# EAGLE design CarBot_Pedro (EAGLE 9.6.2)
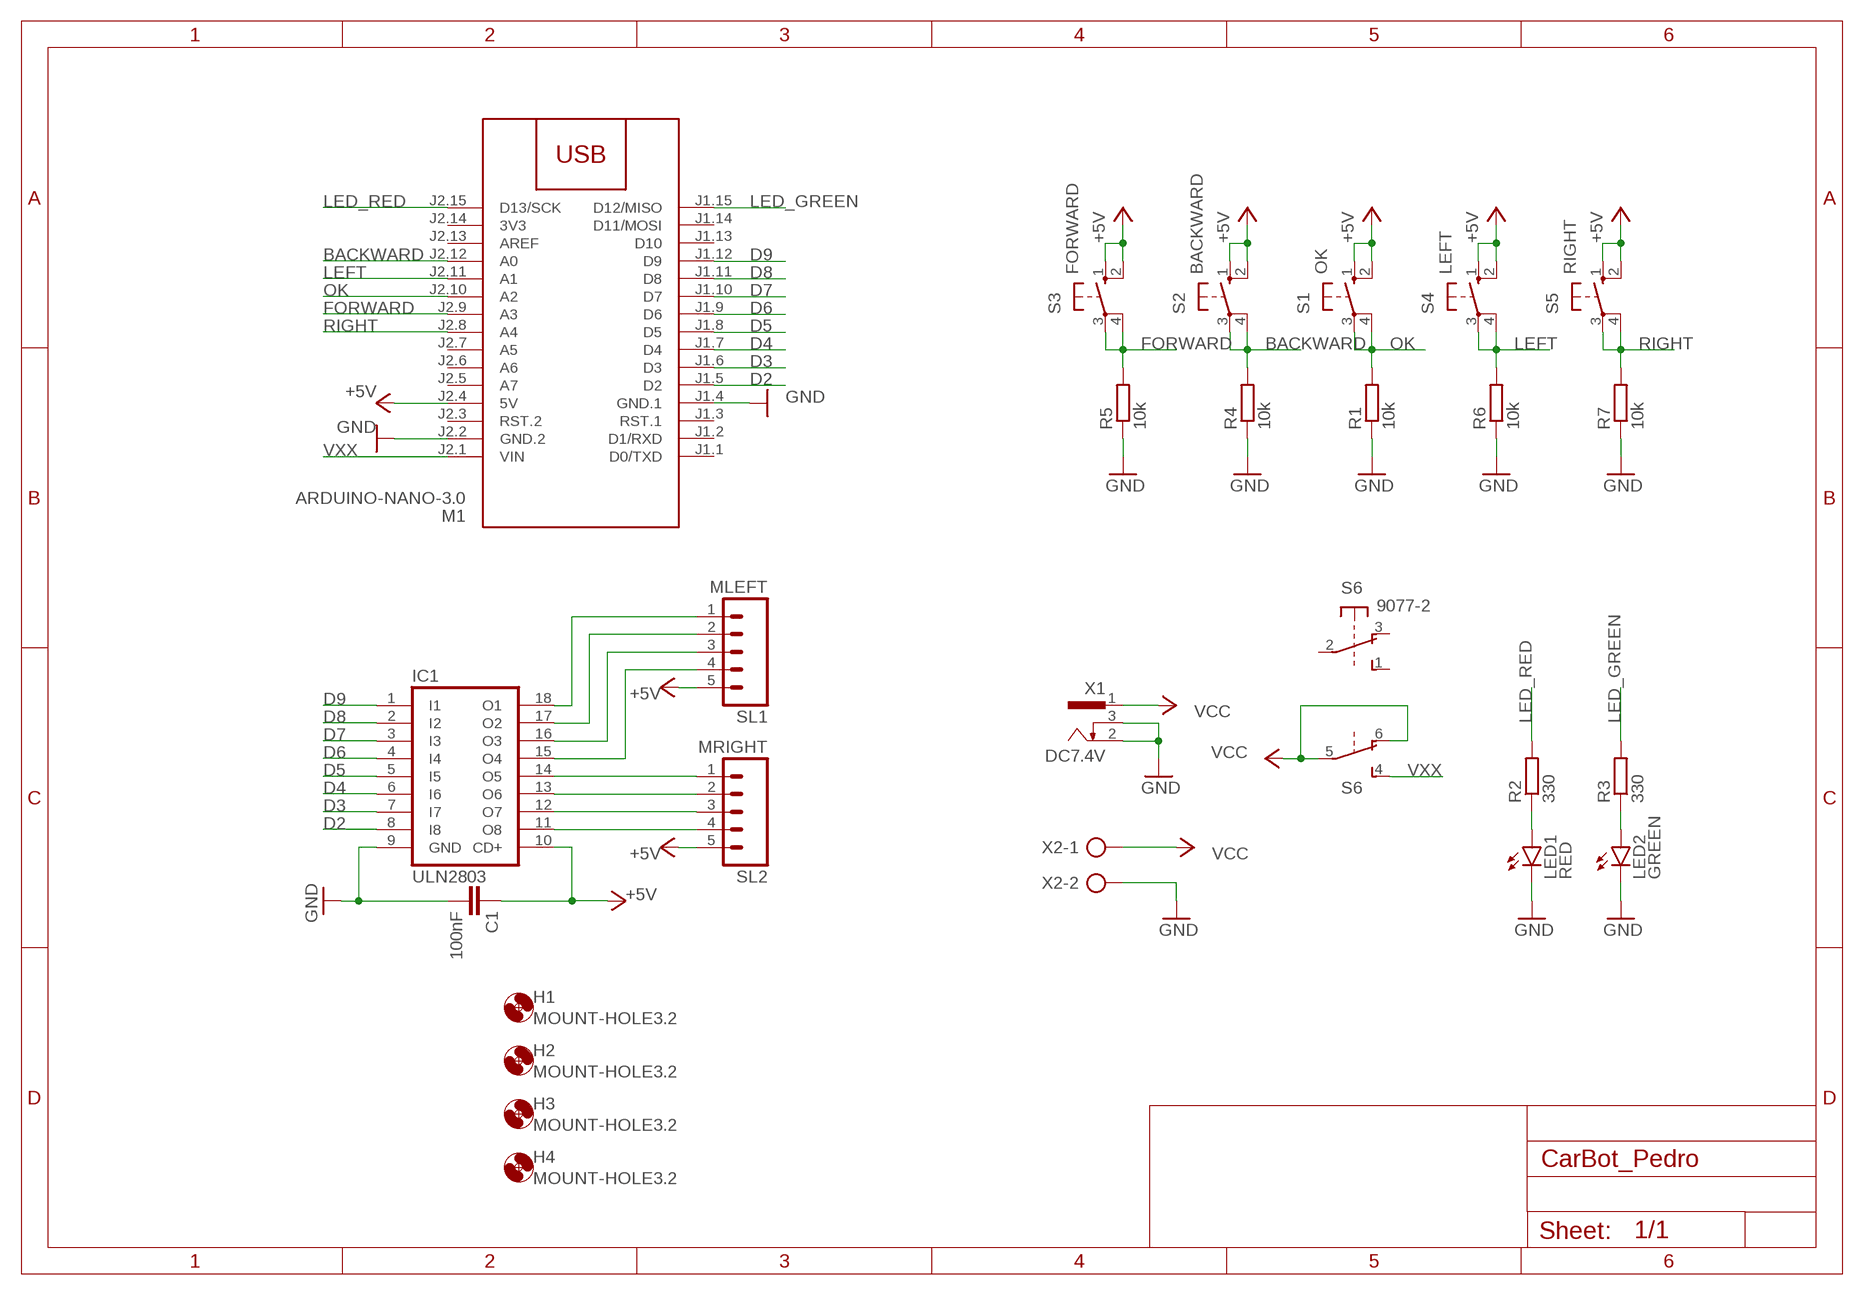
[diagram p0: schematic, sheet 1]

## Parts
C1  100nF  C-EU025-030X050  [C025-030X050]
H1  MOUNT-HOLE3.2  [3,2]
H2  MOUNT-HOLE3.2  [3,2]
H3  MOUNT-HOLE3.2  [3,2]
H4  MOUNT-HOLE3.2  [3,2]
IC1  ULN2803  ULN2803A  [DIL18]
LED1  RED  LED3MM  [LED3MM]
LED2  GREEN  LED3MM  [LED3MM]
M1  ARDUINO-NANO-3.0  [ARDUINO-NANO-3.0]
R1  10k  R-EU_0207/7  [0207/7]
R2  330  R-EU_0207/7  [0207/7]
R3  330  R-EU_0207/7  [0207/7]
R4  10k  R-EU_0207/7  [0207/7]
R5  10k  R-EU_0207/7  [0207/7]
R6  10k  R-EU_0207/7  [0207/7]
R7  10k  R-EU_0207/7  [0207/7]
S1  OK  40-XX  [B3F-40XX]
S2  BACKWARD  40-XX  [B3F-40XX]
S3  FORWARD  40-XX  [B3F-40XX]
S4  LEFT  40-XX  [B3F-40XX]
S5  RIGHT  40-XX  [B3F-40XX]
S6  9077-2  [9077-2]
SL1  MLEFT  M05  [05P]
SL2  MRIGHT  M05  [05P]
X1  DC7.4V  733980-62  [733980-62]
X2  AK500/2-H  [AK500/2-H]

## Nets
+5V: C1.1 IC1.10(CD+) M1.J2.4(5V) S1.1(S) S1.2(S1) S2.1(S) S2.2(S1) S3.1(S) S3.2(S1) S4.1(S) S4.2(S1) S5.1(S) S5.2(S1) SL1.5 SL2.5
BACKWARD: M1.J2.12(A0) R4.2 S2.3(P) S2.4(P1)
D2: IC1.8(I8) M1.J1.5(D2)
D3: IC1.7(I7) M1.J1.6(D3)
D4: IC1.6(I6) M1.J1.7(D4)
D5: IC1.5(I5) M1.J1.8(D5)
D6: IC1.4(I4) M1.J1.9(D6)
D7: IC1.3(I3) M1.J1.10(D7)
D8: IC1.2(I2) M1.J1.11(D8)
D9: IC1.1(I1) M1.J1.12(D9)
FORWARD: M1.J2.9(A3) R5.2 S3.3(P) S3.4(P1)
GND: C1.2 IC1.9(GND) LED1.K(C) LED2.K(C) M1.J1.4(GND.1) M1.J2.2(GND.2) R1.1 R4.1 R5.1 R6.1 R7.1 X1.2 X1.3 X2.2
LED_GREEN: M1.J1.15(D12/MISO) R3.2
LED_RED: M1.J2.15(D13/SCK) R2.2
LEFT: M1.J2.11(A1) R6.2 S4.3(P) S4.4(P1)
N$1: IC1.11(O8) SL2.4
N$2: IC1.12(O7) SL2.3
N$3: IC1.13(O6) SL2.2
N$4: IC1.14(O5) SL2.1
N$5: IC1.15(O4) SL1.4
N$6: IC1.16(O3) SL1.3
N$7: IC1.17(O2) SL1.2
N$8: IC1.18(O1) SL1.1
N$9: LED1.A R2.1
N$10: LED2.A R3.1
OK: M1.J2.10(A2) R1.2 S1.3(P) S1.4(P1)
RIGHT: M1.J2.8(A4) R7.2 S5.3(P) S5.4(P1)
VCC: S6.5(2:P) S6.6(2:O) X1.1 X2.1
VXX: M1.J2.1(VIN) S6.4(2:S)
Unconnected: M1.J1.1(D0/TXD) M1.J1.2(D1/RXD) M1.J1.3(RST.1) M1.J1.13(D10) M1.J1.14(D11/MOSI) M1.J2.3(RST.2) M1.J2.5(A7) M1.J2.6(A6) M1.J2.7(A5) M1.J2.13(AREF) S6.1(1:S) S6.2(1:P) S6.3(1:O)

## Power pins joined to a net without a drawn wire
3V3: M1.J2.14(3V3)

## Library data of the parts
C1 = rcl_ms:C-EU: CAPACITOR, European symbol; SPICEPREFIX: C
H1-H4 = holes:MOUNT-HOLE: MOUNTING HOLE with drill center marker
IC1 = uln-udn:ULN2803A: DRIVER ARRAY
LED1 LED2 = led:LED: LED OSRAM: - CHIPLED LG R971, LG N971, LY N971, LG Q971, LY Q971, LO R971, LY R971 LH N974, LH R974 LS Q976, LO Q976, LY Q976 LO Q996 - Hyper CHIPLED LW Q18S LB Q993, LB Q99A, LB R99A - SideLED LS A670, LO A670, LY A670, LG A670, LP A670 LB A673, LV A673, LT A673, LW A673 LH A674 LY A675 LS A676, LA A676, LO A676, LY A676, LW A676 LS A679, LY A679, LG A679 - Hyper Micro SIDELED® LS Y876, LA Y876, LO Y876, LY Y876 LT Y87S - SmartLED LW L88C, LW L88S LB L89C, LB L89S, LG L890 LS L89K, LO L89K, LY L89K LS L896, LA L896, LO L896, LY L896 - TOPLED LS T670, LO T670, LY T670, LG T670, LP T670 LSG T670, LSP T670, LSY T670, LOP T670, LYG T670 LG T671, LOG T671, LSG T671 LB T673, LV T673, LT T673, LW T673 LH T674 LS T676, LA T676, LO T676, LY T676, LB T676, LH T676, LSB T676, LW T676 LB T67C, LV T67C, LT T67C, LS T67K, LO T67K, LY T67K, LW E67C LS E67B, LA E67B, LO E67B, LY E67B, LB E67C, LV E67C, LT E67C LW T67C LS T679, LY T679, LG T679 LS T770, LO T770, LY T770, LG T770, LP T770 LB T773, LV T773, LT T773, LW T773 LH T774 LS E675, LA E675, LY E675, LS T675 LS T776, LA T776, LO T776, LY T776, LB T776 LHGB T686 LT T68C, LB T68C - Hyper Mini TOPLED® LB M676 - Mini TOPLED Santana® LG M470 LS M47K, LO M47K, LY M47K Source: http://www.osram.convergy.de LUXEON: - LUMILED® LXK2-PW12-R00, LXK2-PW12-S00, LXK2-PW14-U00, LXK2-PW14-V00 LXK2-PM12-R00, LXK2-PM12-S00, LXK2-PM14-U00 LXK2-PE12-Q00, LXK2-PE12-R00, LXK2-PE12-S00, LXK2-PE14-T00, LXK2-PE14-U00 LXK2-PB12-K00, LXK2-PB12-L00, LXK2-PB12-M00, LXK2-PB14-N00, LXK2-PB14-P00, LXK2-PB14-Q00 LXK2-PR12-L00, LXK2-PR12-M00, LXK2-PR14-Q00, LXK2-PR14-R00 LXK2-PD12-Q00, LXK2-PD12-R00, LXK2-PD12-S00 LXK2-PH12-R00, LXK2-PH12-S00 LXK2-PL12-P00, LXK2-PL12-Q00, LXK2-PL12-R00 Source: www.luxeon.com KINGBRIGHT: KA-3528ASYC Source: www.kingbright.com
M1 = diy-modules_ms:ARDUINO-NANO-3.0: Arduino Nano 3.0
R1-R7 = rcl_ms:R-EU_: RESISTOR, European symbol; SPICEPREFIX: R
S1-S5 = switch-omron:40-XX: OMRON SWITCH; MF: OMRON COMPONENTS USA; MPN: B3F-4000; OC_FARNELL: 176434; OC_NEWARK: 36K3105
S6 = switch-misc:9077-2: MARQUARDT SWITCH 9077.0200 Distributor: Buerklin <https://www.buerklin.com/default.asp?event=ShowArtikel%2812G2822%29&l=d&jump=ArtNr_12G2822>
SL1 SL2 = con-amp-quick_ms:M05: AMP QUICK CONNECTOR; OC_FARNELL: unknown; OC_NEWARK: unknown
X1 = con-conrad:73398?: FEMALE PRINT CONNECTOR Niedervolt-Steckverbinder Distributor Conrad
X2 = Borneras:AK500/2-H: CONNECTOR Aug. 2004 / PTR Meßtechnik: Die Bezeichnung der Serie AK505 wurde geändert. Es handelt sich hierbei um AK500 in horizontaler Ausführung.; OC_FARNELL: unknown; OC_NEWARK: unknown

## Board
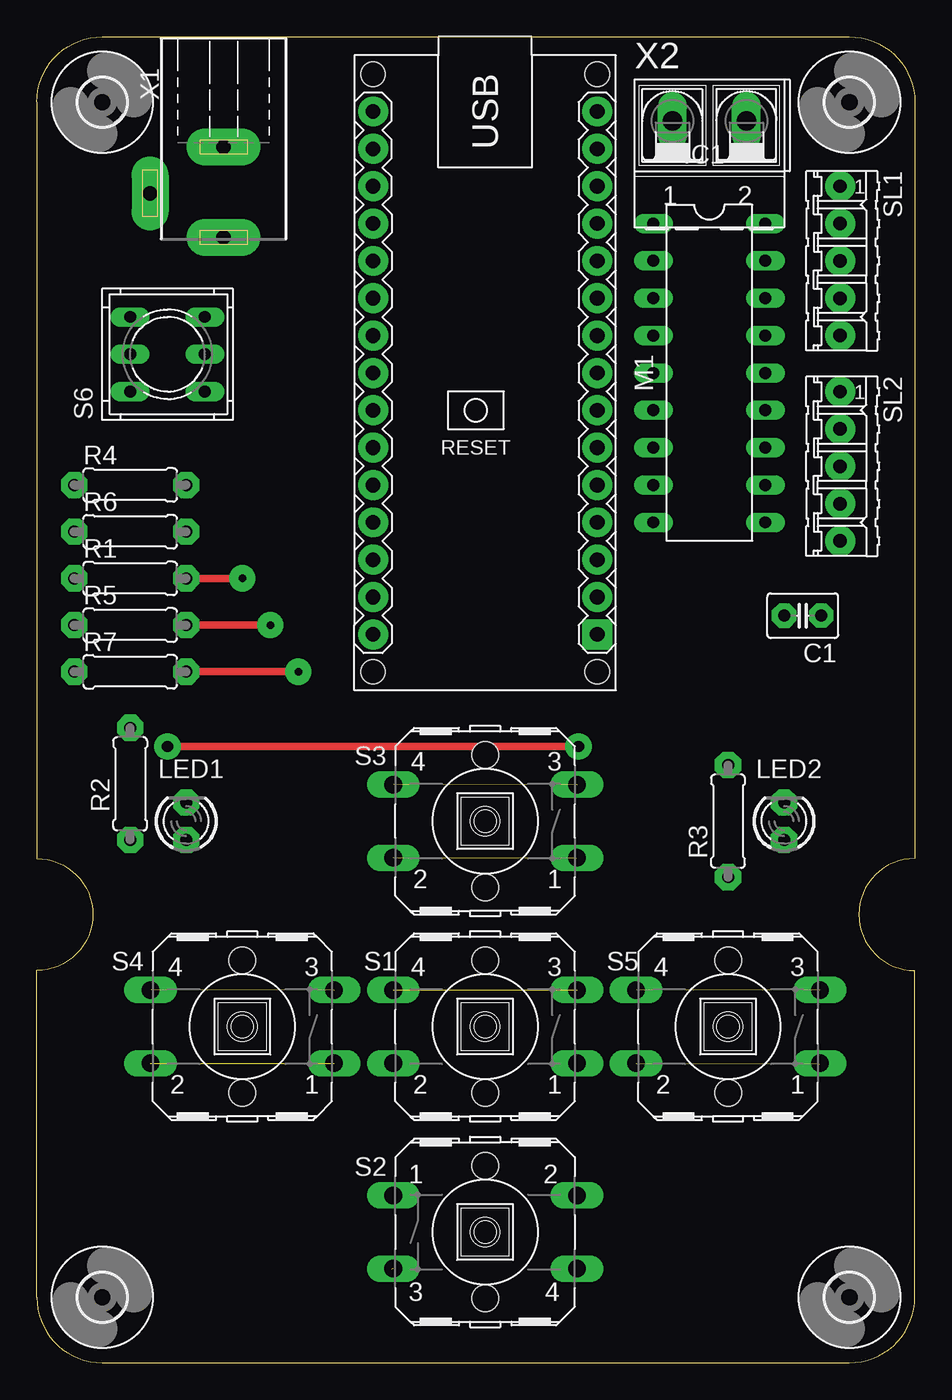
[diagram p1: board, top side]
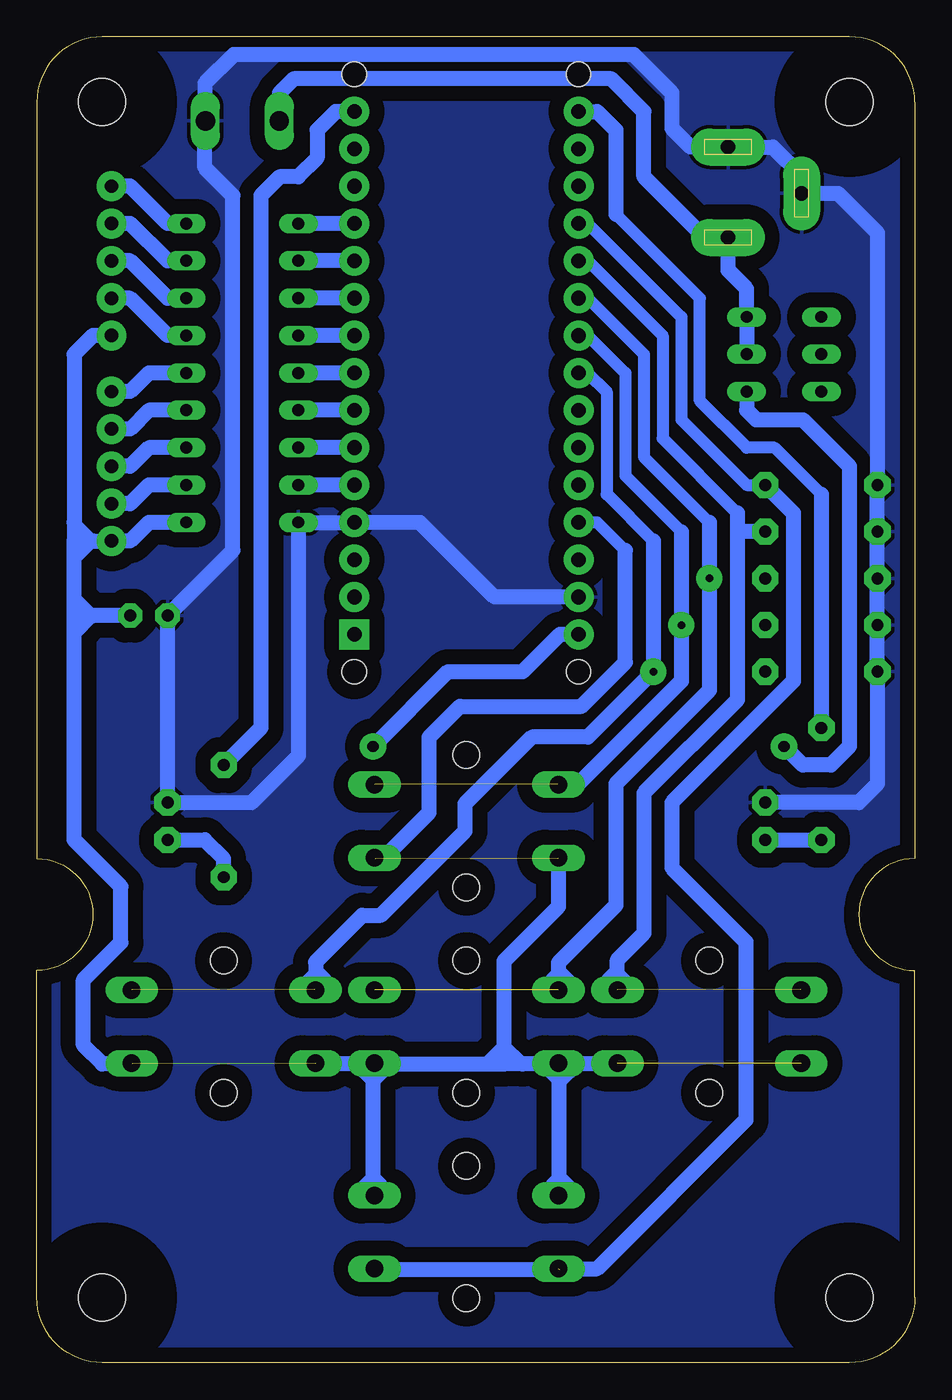
[diagram p2: board, bottom side, seen from below]

Size 59.69 x 90.17 mm. Coordinates in mm from the lower left corner, seen from the top.
Outline: 0,4.45 0,26.67 arc180 0,34.29 0,85.72 arc-90 4.45,90.17 55.24,90.17 arc-90 59.69,85.72 59.69,34.29 arc180 59.69,26.67 59.69,4.45 arc-90 55.24,0 4.45,0 arc-90 0,4.45
Copper layers (1*16): Top 0.035mm / dielectric 0.15mm / Bottom 0.035mm
Design rules "default": minimum track width 6mil, minimum drill 0.35mm, track to track 6mil, track to pad 6mil, pad to pad 6mil, via to via 6mil, smd to smd 6mil, copper to edge 40mil, drill to drill 6mil, minimum pad ring 10mil, minimum via ring 8mil, stop-mask expansion 4mil, vias tented up to drill 0mil, thermal gap 10mil

### Footprints (pad centres in the part's own frame; a part is rotated, then mirrored left to right if it is on the bottom)
C025-030X050 = drill 0.813 pad 1.626 octagon: 1 -1.27,0 | drill 0.813 pad 1.651 octagon: 2 1.27,0
3,2 = hole 3.2: 0,0
DIL18 = drill 0.813 long: 1 -10.16,-3.81; 2 -7.62,-3.81; 3 -5.08,-3.81; 4 -2.54,-3.81; 5 0,-3.81; 6 2.54,-3.81; 7 5.08,-3.81; 8 7.62,-3.81; 9 10.16,-3.81; 10 10.16,3.81; 11 7.62,3.81; 12 5.08,3.81; 13 2.54,3.81; 14 0,3.81; 15 -2.54,3.81; 16 -5.08,3.81; 17 -7.62,3.81; 18 -10.16,3.81
LED3MM = drill 0.813 pad 1.778 octagon: A -1.27,0; K 1.27,0
ARDUINO-NANO-3.0 = drill 1 pad 2.032 square: J1.1 17.78,7.62 | drill 1 pad 2.032: J1.2 15.24,7.62; J1.3 12.7,7.62; J1.4 10.16,7.62; J1.5 7.62,7.62; J1.6 5.08,7.62; J1.7 2.54,7.62; J1.8 0,7.62; J1.9 -2.54,7.62; J1.10 -5.08,7.62; J1.11 -7.62,7.62; J1.12 -10.16,7.62; J1.13 -12.7,7.62; J1.14 -15.24,7.62; J1.15 -17.78,7.62; J2.1 17.78,-7.62; J2.2 15.24,-7.62; J2.3 12.7,-7.62; J2.4 10.16,-7.62; J2.5 7.62,-7.62; J2.6 5.08,-7.62; J2.7 2.54,-7.62; J2.8 0,-7.62; J2.9 -2.54,-7.62; J2.10 -5.08,-7.62; J2.11 -7.62,-7.62; J2.12 -10.16,-7.62; J2.13 -12.7,-7.62; J2.14 -15.24,-7.62; J2.15 -17.78,-7.62 | hole 1.651: -20.32,7.62; -20.32,-7.62; 20.32,-7.62; 20.32,7.62
0207/7 = drill 0.813 pad 1.778 octagon: 1 -3.81,0; 2 3.81,0
B3F-40XX = drill 1.194 long: 1 -6.248,2.489; 2 6.248,2.489; 3 -6.248,-2.489; 4 6.248,-2.489 | hole 1.803: 0,-4.496; 0,4.496
9077-2 = drill 0.813 long: 1 -2.54,2.54; 2 0,2.54; 3 2.54,2.54; 4 -2.54,-2.54; 5 0,-2.54; 6 2.54,-2.54
05P = drill 0.914 pad 2.032: 1 -5.08,0; 2 -2.54,0; 3 0,0; 4 2.54,0; 5 5.08,0
733980-62 = drill 1 pad 2.5 long: 1 0,8.57; 2 0,2.42; 3 5,5.57
AK500/2-H = drill 1.321 long: 1 -2.515,0; 2 2.515,0

### Placement (x,y rotation side)
C1  52.07,50.8 180 top
H1  4.45,4.45 0 top
H2  55.24,4.45 0 top
H3  55.24,85.72 0 top
H4  4.45,85.72 0 top
IC1  45.72,67.31 270 top
LED1  10.16,36.83 90 top
LED2  50.8,36.83 90 top
M1  30.48,67.31 270 top
R1  6.35,53.34 0 top
R2  6.35,39.37 90 top
R3  46.99,36.83 90 top
R4  6.35,59.69 0 top
R5  6.35,50.16 0 top
R6  6.35,56.52 0 top
R7  6.35,46.99 0 top
S1  30.48,22.86 180 top
S2  30.48,8.89 0 top
S3  30.48,36.83 180 top
S4  13.97,22.86 180 top
S5  46.99,22.86 180 top
S6  8.89,68.58 90 top
SL1  54.61,74.93 270 top
SL2  54.61,60.96 270 top
X1  12.7,85.09 180 top
X2  45.72,84.45 0 top

### Tracks (layer width: path | path; a pad name or v marks a point on that pad's centre or on a via)
+5V  (3 unrouted)
  Bottom 0.813: 19.68,55.24 21.59,57.15 M1.J2.4 | 57.15,52.07 55.88,50.8 57.15,49.53 | 57.15,54.61 55.88,55.88 57.15,57.15 | 25.4,20.32 24.13,19.05 22.86,20.32 | 38.1,20.32 36.83,19.05 35.56,20.32 | 26.67,20.32 27.94,21.59 29.21,20.32 | 35.56,11.43 36.83,12.7 38.1,11.43
  Bottom 1.016: IC1.10 52.07,57.15 53.34,55.88 SL2.5 55.88,55.88 57.15,55.88 | SL1.5 55.88,69.85 57.15,68.58 57.15,57.15 57.15,55.88 | 53.19,20.32 S5.1 53.29,20.32 55.24,20.32 56.52,21.59 56.52,26.04 53.98,28.57 53.98,32.38 57.15,35.56 57.15,49.53 57.15,50.8 | 24.18,20.32 22.86,20.32 20.32,20.32 20.27,20.37 S4.1 | 24.18,20.32 25.4,20.32 26.67,20.32 27.94,20.32 | 36.83,20.32 35.56,20.32 29.21,20.32 27.94,20.32 | 36.83,20.32 38.1,20.32 40.69,20.32 S5.2 | S4.2 7.67,20.32 7.62,20.32 | S1.2 24.18,20.32 | S1.1 36.78,20.37 36.83,20.32 | S2.1 24.18,11.43 24.18,20.32 | S2.2 36.83,11.48 36.83,12.7 36.83,19.05 36.83,20.32 | 36.68,34.29 S3.1 36.09,34.34 33.02,37.41 33.02,42.55 30.92,44.64 22.67,44.64 19.68,47.62 19.68,55.24 | S3.2 24.23,31.01 27.94,27.3 27.94,21.59 27.94,20.32 | C1.1 55.88,50.8 57.15,50.8 | 57.15,50.8 57.15,52.07 57.15,54.61 57.15,55.88
BACKWARD  (1 unrouted)
  Bottom 0.61: S2.4 36.68,6.35
  Bottom 0.813: M1.J2.12 22.23,77.47 15.88,71.12 15.88,64.14 11.43,59.69 R4.2
  Bottom 1.016: R4.2 8.26,57.78 8.26,46.35 16.51,38.1 16.51,33.66 11.48,28.63 11.48,16.51 21.59,6.4 S2.3 | 36.68,6.35 24.13,6.35
D2
  Bottom 1.016: M1.J1.5 IC1.8
D3
  Bottom 1.016: M1.J1.6 IC1.7
D4
  Bottom 1.016: M1.J1.7 IC1.6
D5
  Bottom 1.016: M1.J1.8 IC1.5
D6
  Bottom 1.016: M1.J1.9 IC1.4
D7
  Bottom 1.016: M1.J1.10 IC1.3
D8
  Bottom 1.016: M1.J1.11 IC1.2
D9
  Bottom 1.016: M1.J1.12 IC1.1
FORWARD  (via drill 0.51 pad 1.78)  (1 unrouted)
  Top 0.508: v15.88,50.16 R5.2
  Bottom 0.61: S3.4 24.28,39.37
  Bottom 0.813: M1.J2.9 22.23,69.85 19.68,67.31 19.68,60.33 15.88,56.52
  Bottom 1.016: 15.88,56.52 v15.88,50.16 15.88,46.35 22.91,39.32 S3.4
GND
  Bottom 1.016: LED1.K 3.81,38.1 2.54,39.37 R7.1 R5.1 R1.1 R6.1 R4.1 2.54,76.83 5.22,79.52 X1.3 7.7,80.72 9.64,82.67 X1.2 15.24,82.67 16.51,83.94 16.51,86.36 19.1,88.95 46.3,88.95 48.26,87 48.26,84.48 | 48.26,84.48 X2.2 | 48.26,84.48 48.26,81.28 46.35,79.38 46.35,55.24 C1.2 LED2.K 45.09,38.1 41.91,41.27 IC1.9 M1.J1.4 33.66,57.15 28.57,52.07 M1.J2.2
  pour Bottom (isolate 1.016): 0,90.81 0,0 59.69,0 59.69,90.81
LED_GREEN
  Bottom 1.016: R3.2 44.45,43.18 44.45,79.38 43.18,80.64 41.91,80.64 40.64,81.92 40.64,83.82 39.37,85.09 M1.J1.15
LED_RED
  Bottom 0.813: 20.32,78.11 14.61,72.39 14.61,65.41 11.43,62.23 9.53,62.23 6.35,59.05
  Bottom 1.016: M1.J2.15 21.59,85.09 20.32,83.82 20.32,78.11 | 6.35,59.05 R2.2
LEFT  (1 unrouted)
  Bottom 0.61: S4.4 7.77,25.4
  Bottom 0.813: M1.J2.11 22.23,74.93 17.14,69.85 17.14,62.87 12.06,57.78
  Bottom 1.016: S4.3 20.22,27.41 18.41,29.21 18.41,38.73 12.06,45.09 12.06,56.52 | 12.06,57.78 12.06,56.52 | R6.2 12.06,56.52
N$1
  Bottom 1.016: IC1.11 52.07,59.69 53.34,58.42 SL2.4
N$2
  Bottom 1.016: IC1.12 52.07,62.23 53.34,60.96 SL2.3
N$3
  Bottom 1.016: IC1.13 52.07,64.77 53.34,63.5 SL2.2
N$4
  Bottom 1.016: IC1.14 52.07,67.31 53.34,66.04 SL2.1
N$5
  Bottom 1.016: IC1.15 50.8,69.85 53.34,72.39 SL1.4
N$6
  Bottom 1.016: IC1.16 50.8,72.39 53.34,74.93 SL1.3
N$7
  Bottom 1.016: IC1.17 50.8,74.93 53.34,77.47 SL1.2
N$8
  Bottom 1.016: IC1.18 50.8,77.47 53.34,80.01 SL1.1
N$9
  Bottom 1.016: LED1.A R2.1
N$10
  Bottom 1.016: LED2.A 48.26,35.56 46.99,34.29 R3.1
N$11
  Bottom 0.813: 22.86,25.4 24.13,26.67 25.4,25.4
N$12
  Bottom 0.813: 19.05,25.4 20.32,26.67 21.59,25.4
N$13
  Bottom 0.813: 39.37,25.4 40.64,26.67 41.91,25.4
N$14
  Bottom 0.813: 22.86,11.43 24.13,12.7 25.4,11.43
OK  (via drill 0.51 pad 1.78)  (1 unrouted)
  Top 0.508: v13.97,53.34 R1.2
  Bottom 0.813: M1.J2.10 22.23,72.39 18.41,68.58 18.41,61.59 13.97,57.15
  Bottom 1.016: 13.97,57.15 v13.97,53.34 13.97,45.72 20.32,39.37 20.32,31.11 24.23,27.2 S1.4
RIGHT  (via drill 0.51 pad 1.78)  (1 unrouted)
  Top 0.508: v17.78,46.99 R7.2
  Bottom 0.61: S5.4 40.79,25.4
  Bottom 0.813: M1.J2.8 22.23,67.31 20.95,66.04 20.95,59.05 17.78,55.88
  Bottom 1.016: 17.78,55.88 v17.78,46.99 22.23,42.55 26.04,42.55 30.58,38 30.58,36.14 36.3,30.43 37.57,30.43 40.74,27.25 S5.4
VCC
  Bottom 1.016: X2.1 43.18,84.48 43.18,86.36 42.23,87.31 20.64,87.31 18.41,85.09 18.41,80.64 14.29,76.52 X1.1 12.7,74.3 11.43,73.03 S6.6 S6.5
VXX  (via drill 0.76 pad 1.78)
  Top 0.508: v8.89,41.91 v36.83,41.91
  Bottom 1.016: S6.4 11.43,64.77 10.79,64.14 7.62,64.14 4.45,60.96 4.45,41.91 5.71,40.64 7.62,40.64 v8.89,41.91 | M1.J2.1 24.13,49.53 26.67,46.99 31.75,46.99 v36.83,41.91